# EAGLE design MMA8452Q-breakout-v1_1 (EAGLE 6.5.0)
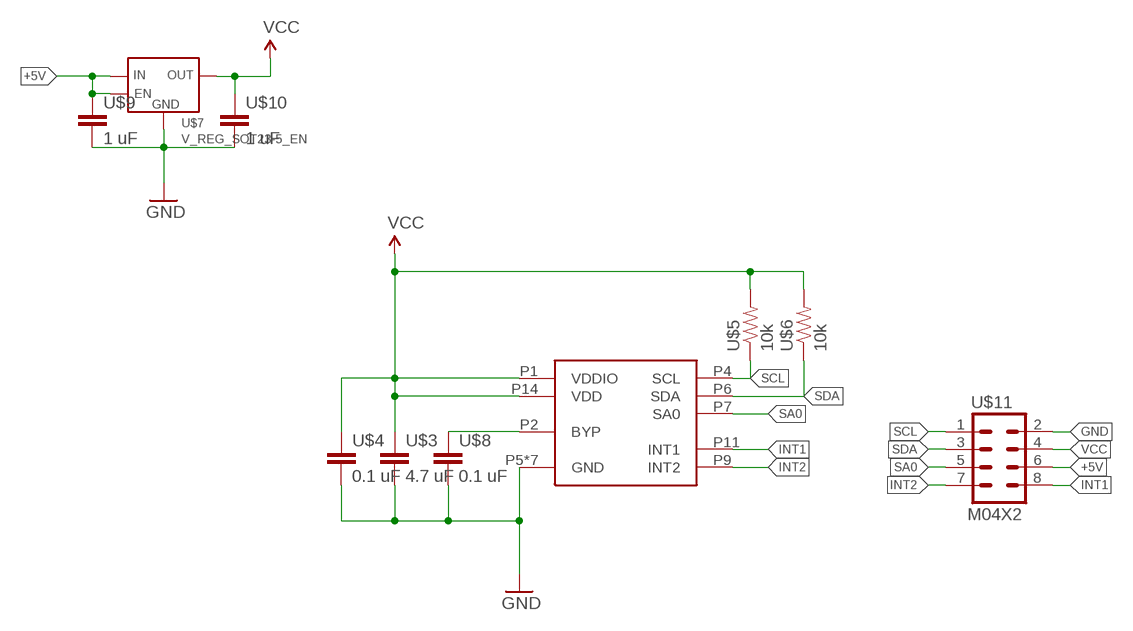
[diagram p0: schematic, sheet 1]

## Parts
U$2  MMA_8452  [QFN-16-MMA]
U$3  4.7 uF  CAPCAP-0603  [CAP-0603]
U$4  0.1 uF  CAPCAP-0603  [CAP-0603]
U$5  10k  RESISTOR0603  [RES-0603]
U$6  10k  RESISTOR0603  [RES-0603]
U$7  V_REG_SOT23-5_EN  [SOT23-5]
U$8  0.1 uF  CAPCAP-0603  [CAP-0603]
U$9  1 uF  CAPCAP-0603  [CAP-0603]
U$10  1 uF  CAPCAP-0603  [CAP-0603]
U$11  M04X2  [2X4]

## Nets
+5V: U$7.1(IN) U$7.3(EN) U$9.1 U$11.6
BYP: U$2.P2(BYP) U$8.1
GND: U$2.P5(GND) U$2.P8(GND) U$2.P10(GND) U$2.P12(GND) U$2.P13(GND) U$2.P15(GND) U$2.P16(GND) U$3.2 U$4.2 U$7.2(GND) U$8.2 U$9.2 U$10.2 U$11.2
INT1: U$2.P11(INT1) U$11.8
INT2: U$2.P9(INT2) U$11.7
SA0: U$2.P7(SA0) U$11.5
SCL: U$2.P4(SCL) U$5.1 U$11.1
SDA: U$2.P6(SDA) U$6.1 U$11.3
VCC: U$2.P1(VDDIO) U$2.P14(VDD) U$3.1 U$4.1 U$5.2 U$6.2 U$7.5(OUT) U$10.1 U$11.4

## Library data of the parts
U$2 = Xmas-Ornament:MMA_8452
U$3 U$4 U$8-U$10 = LITTLEBITS140915:CAP
U$5 U$6 = LITTLEBITS140915:RESISTOR
U$7 = LITTLEBITS140915:V_REG_SOT23-5_EN: Generic device for a SOT23-5 surface mount LDO voltage regulator
U$11 = SparkFun-Connectors:M04X2: .1" header, two rows of four.

## Board
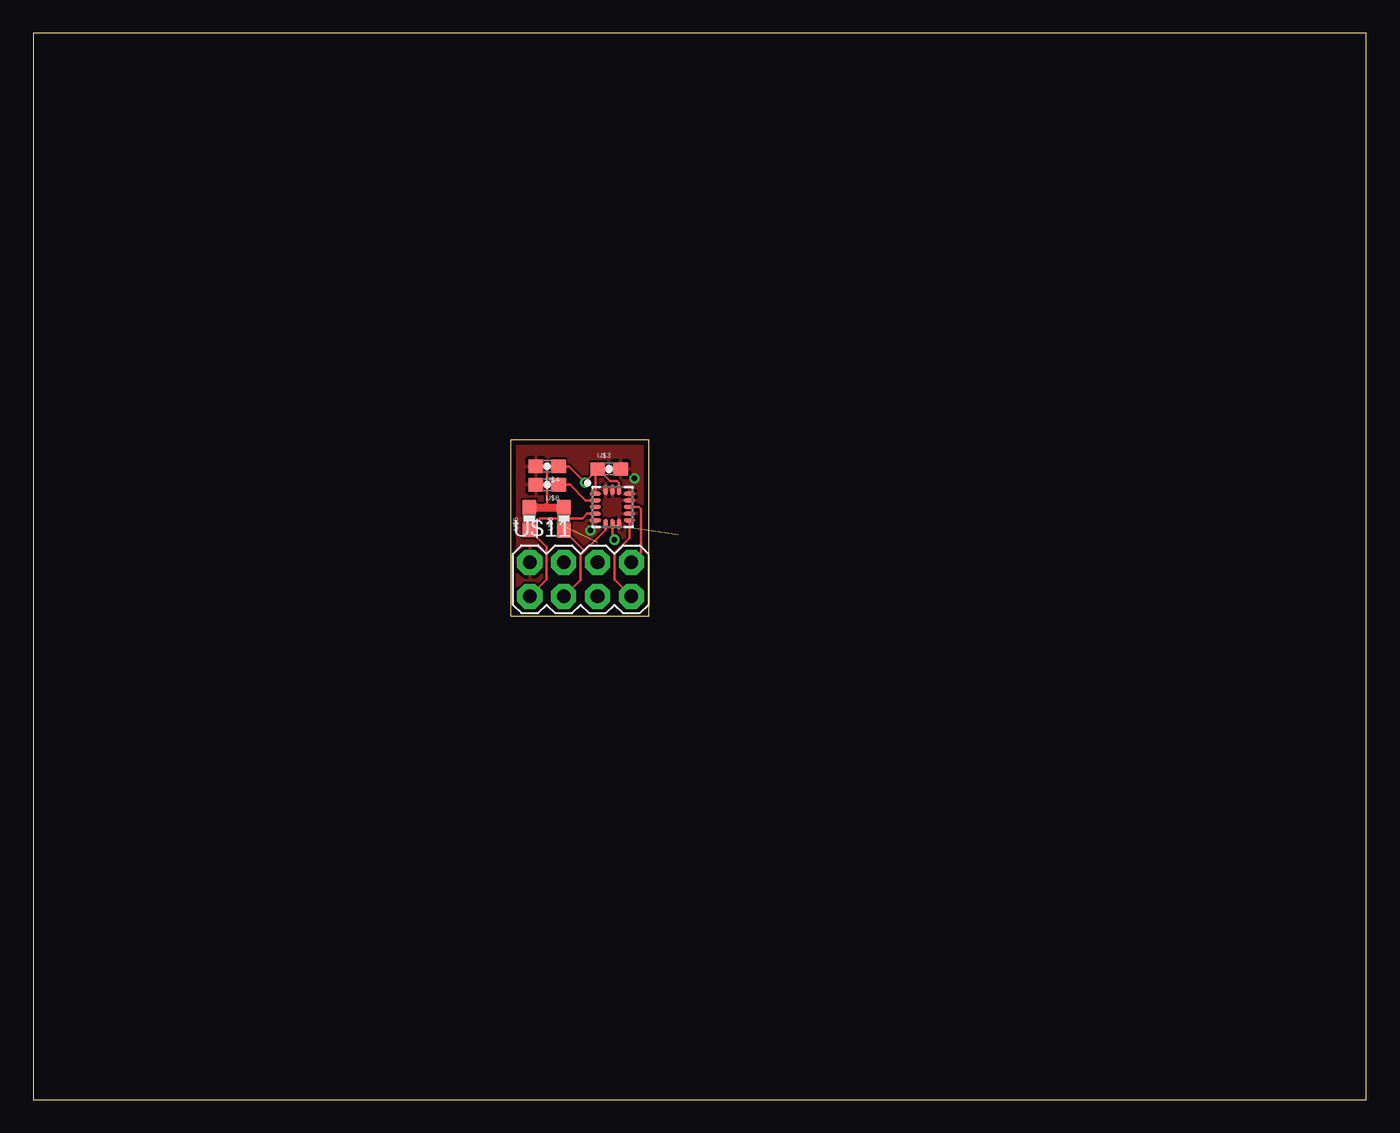
[diagram p1: board, top side]
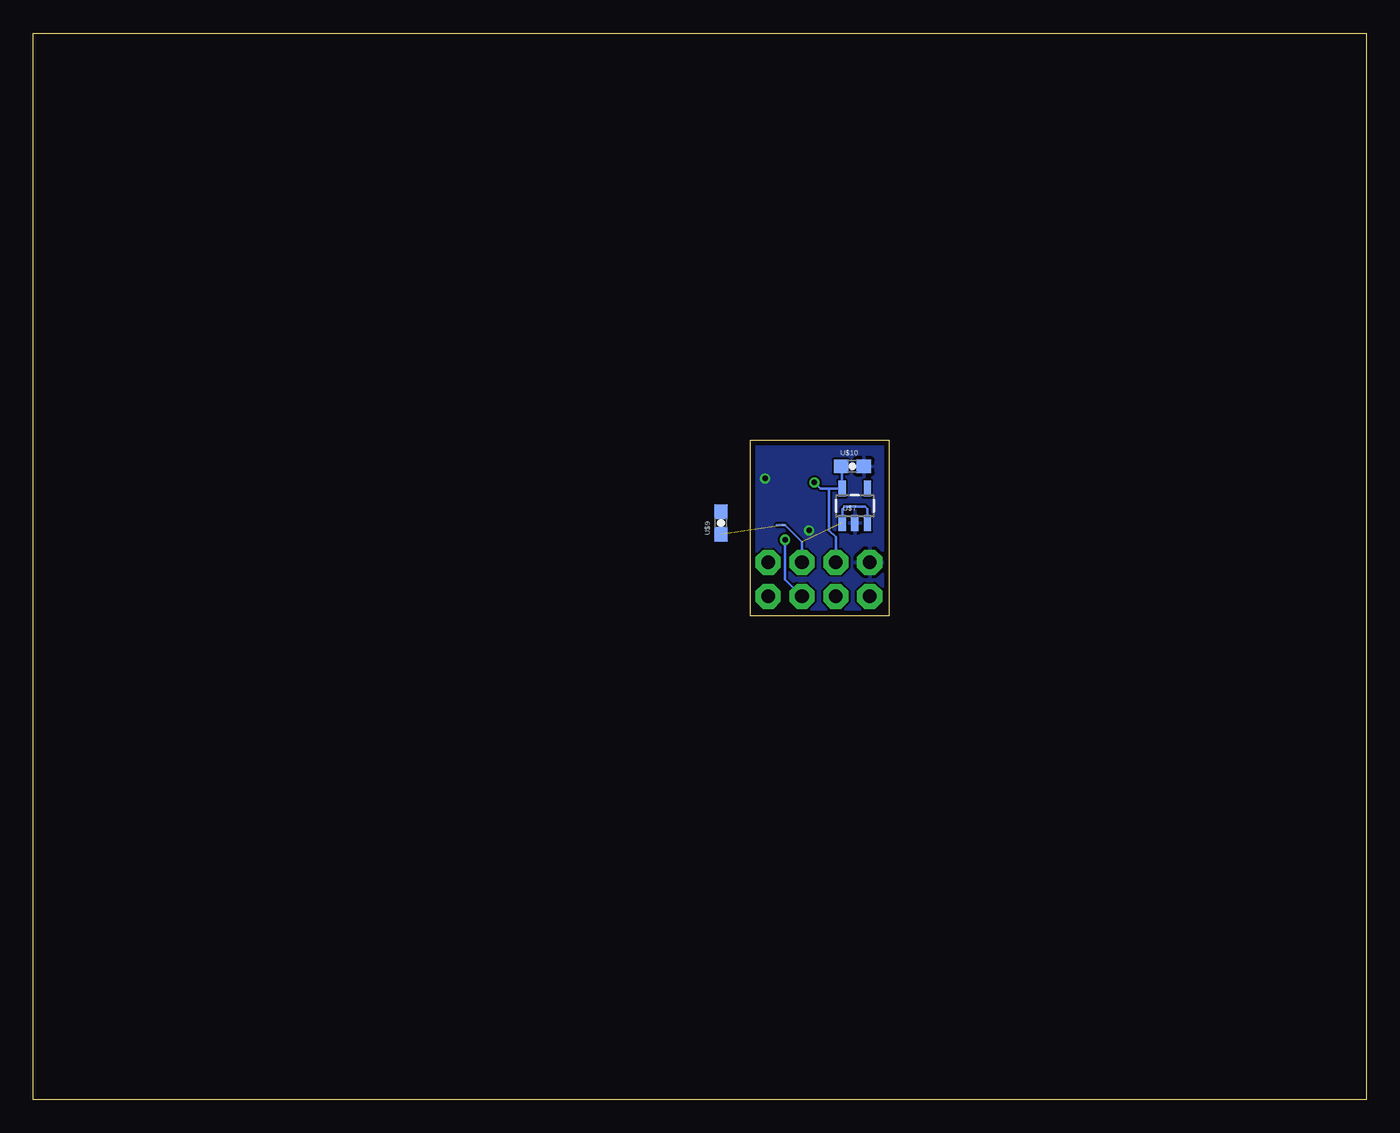
[diagram p2: board, bottom side, seen from below]

Size 100 x 80 mm. Coordinates in mm from the lower left corner, seen from the top.
Outline: 0,0 100,0 100,80 0,80 0,0
Outline: 35.8,36.3 46.2,36.3 46.2,49.5 35.8,49.5 35.8,36.3
Copper layers (1*16): Top 0.0356mm / dielectric 1.5011mm / Bottom 0.0356mm
Design rules "LaenPCBOrder": minimum track width 6mil, minimum drill 13mil, track to track 6mil, track to pad 6mil, pad to pad 6mil, via to via 6mil, smd to smd 6mil, copper to edge 15mil, drill to drill 6mil, minimum pad ring 7mil, minimum via ring 7mil, stop-mask expansion 3mil, vias tented up to drill 0mil, thermal gap 10mil

### Footprints (pad centres in the part's own frame; a part is rotated, then mirrored left to right if it is on the bottom)
QFN-16-MMA = smd 0.813 x 0.305: P1 -1.275,1; P2 -1.275,0.5; P3 -1.275,0; P4 -1.275,-0.5; P5 -1.275,-1; P9 1.275,-1; P10 1.275,-0.5; P11 1.275,0; P12 1.275,0.5; P13 1.275,1 | smd 0.305 x 0.813: P6 -0.5,-1.275; P7 0,-1.275; P8 0.5,-1.275; P14 0.5,1.275; P15 0,1.275; P16 -0.5,1.275
CAP-0603 = smd 1.1 x 1: 1 -0.85,0; 2 0.85,0
RES-0603 = smd 1.1 x 1: 1 -0.85,0; 2 0.85,0
SOT23-5 = smd 0.55 x 1.2: 1 -0.95,-1.3; 2 0,-1.3; 3 0.95,-1.3; 4 0.95,1.3; 5 -0.95,1.3
2X4 = drill 1.016 pad 1.88 octagon: 1 -3.81,-1.27; 2 -3.81,1.27; 3 -1.27,-1.27; 4 -1.27,1.27; 5 1.27,-1.27; 6 1.27,1.27; 7 3.81,-1.27; 8 3.81,1.27

### Placement (x,y rotation side)
U$2  43.44,44.46 0 top
U$3  43.21,47.31 0 top
U$4  38.55,47.51 180 top
U$5  37.21,43.59 90 top
U$6  39.81,43.58 90 top
U$7  38.37,44.54 0 bottom
U$8  38.56,46.13 180 top
U$9  48.41,43.26 90 bottom
U$10  38.55,47.51 0 bottom
U$11  41.06,39.03 0 top

### Tracks (layer width: path | path; a pad name or v marks a point on that pad's centre or on a via)
+5V  (2 unrouted)
  Bottom 0.2: U$11.6 42.33,41.83 43.6,43.1 44.2,43.1 | U$7.3 37.42,44.32 37.6,44.5 39.1,44.5 39.3,44.3 39.3,43.26 U$7.1
BYP
  Top 0.2: U$8.1 40.27,46.13 41.44,44.96 U$2.P2
GND  (via drill 0.41)
  other vias: 41.8,42.7 45.1,46.6
  pour Bottom: 35.8,36.3 46.2,36.3 46.2,49.5 35.8,49.5
  pour Top: 35.8,36.3 46.2,36.3 46.2,49.5 35.8,49.5
INT1
  Top 0.2: U$2.P11 45.44,44.46 45.6,44.3 45.6,41.03 U$11.8
INT2
  Top 0.2: U$2.P9 44.72,42.12 43.6,41 43.6,39.03 U$11.7
SA0  (via drill 0.41)
  Top 0.2: U$2.P7 43.44,42.16 v43.6,42
  Bottom 0.2: v43.6,42 43.6,39.03 U$11.5
SCL
  Top 0.2: U$2.P4 41.56,43.96 41.2,43.6 38,43.6 37.21,42.81 U$5.1 38.5,41.45 38.5,39.01 U$11.1
SDA
  Top 0.2: U$2.P6 42.94,42.74 41.35,41.15 | U$11.3 39.81,37.76 41.05,39 41.05,40.85 41.35,41.15 | U$6.1 39.81,42.69 41.35,41.15
VCC  (via drill 0.41)
  Top 0.2: U$3.1 42.16,47.52 U$2.P1 42.14,45.46 | U$6.2 39.77,44.43 | U$2.P14 43.94,46.26 43.8,46.4 43.27,46.4 U$3.1 | U$3.1 41.4,46.35 v41.4,46.3 40.19,47.51 U$10.1 38.86,47.51 38.55,47.2 38.55,44.58 38.4,44.43
  Top 0.61: U$5.2 37.72,44.43 38.4,44.43 U$6.2
  Bottom 0.2: U$10.1 39.32,47.43 U$7.5 40.4,45.84 | 40.4,45.84 40.94,45.84 v41.4,46.3 | U$11.4 39.79,42.19 40.3,42.7 40.3,45.74 40.4,45.84